# EAGLE schematic Test_Board_RevII (EAGLE 7.1.0)
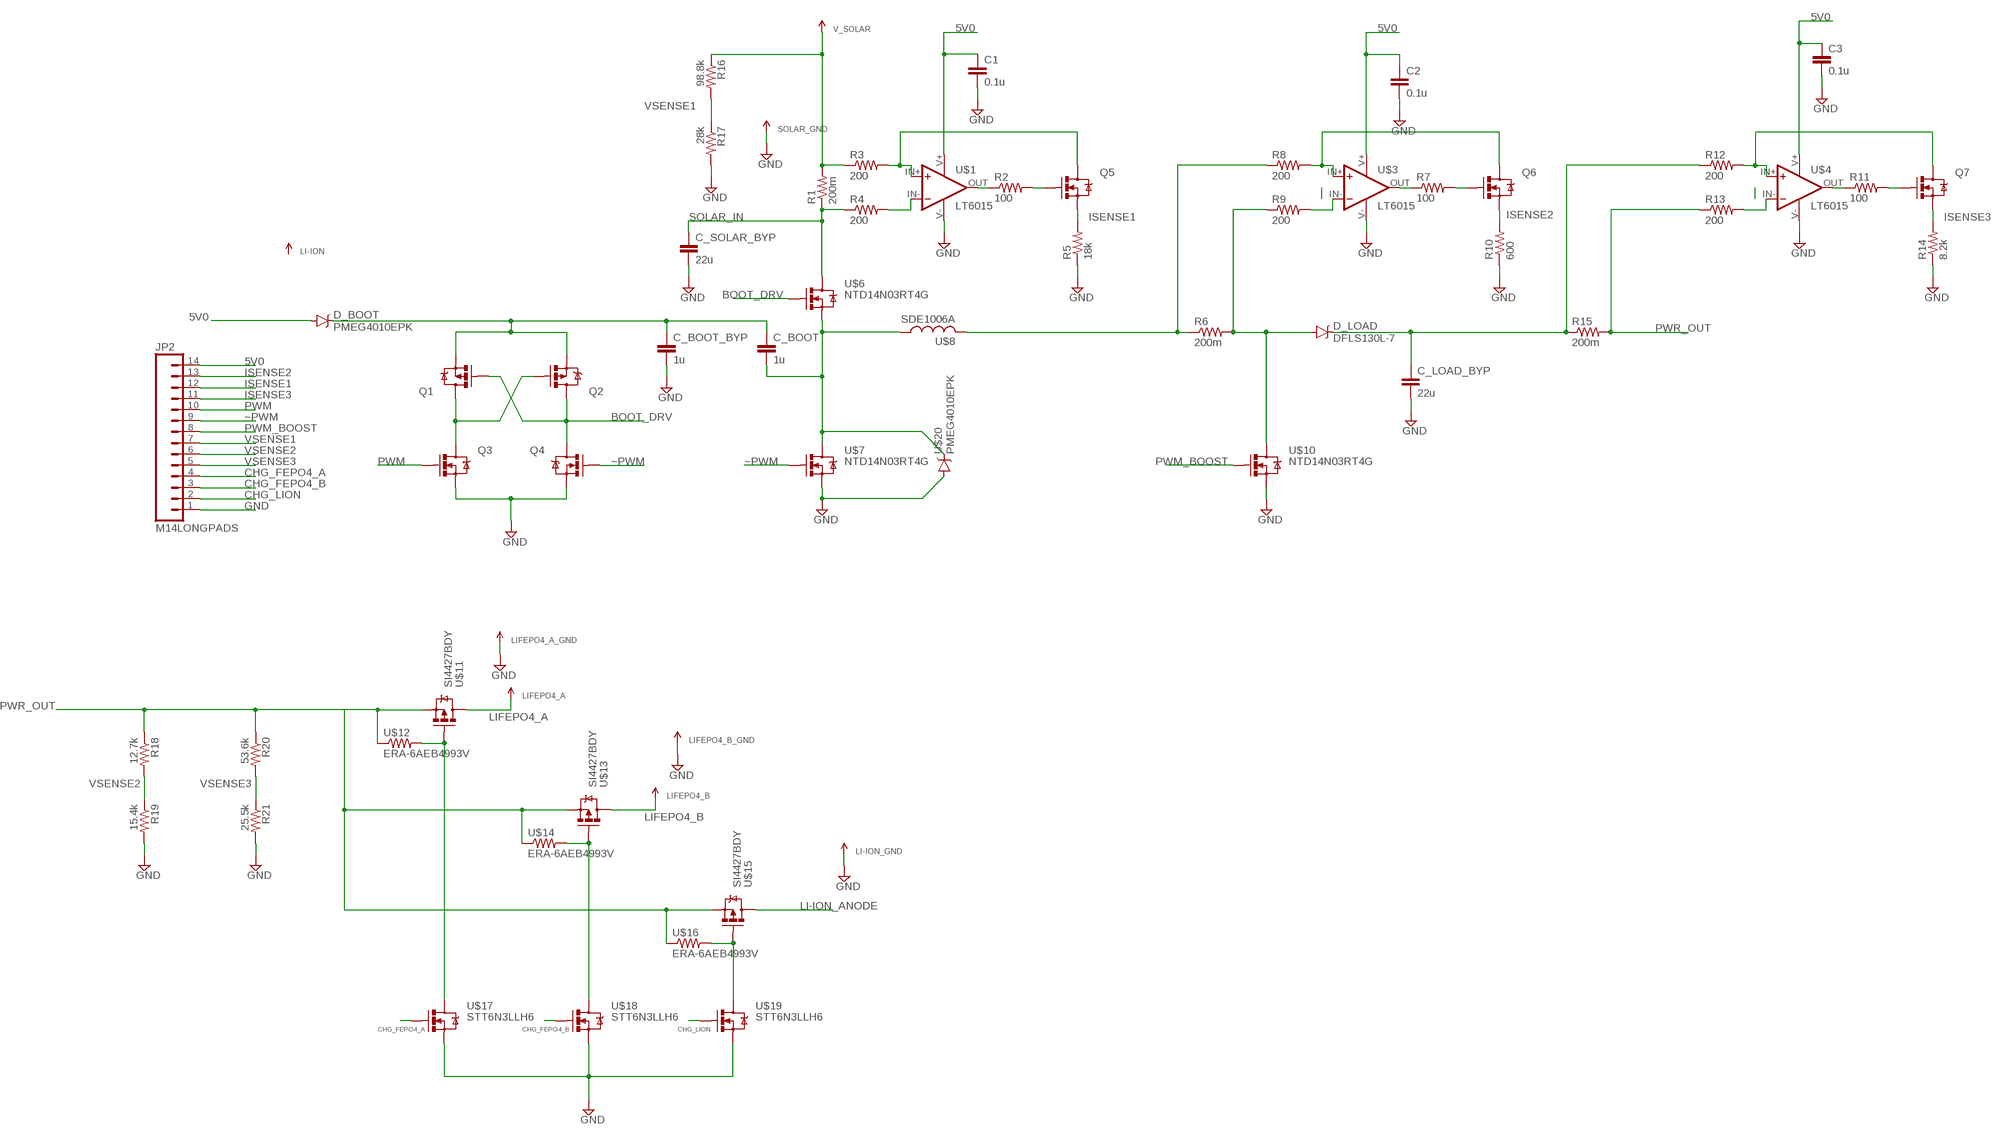
[diagram p0: schematic, sheet 1]

## Parts
C1  0.1u  CAP0805  [0805]
C2  0.1u  CAP0805  [0805]
C3  0.1u  CAP0805  [0805]
C_BOOT  1u  CAP0805  [0805]
C_BOOT_BYP  1u  CAP0805  [0805]
C_LOAD_BYP  22u  CAP1210  [1210]
C_SOLAR_BYP  22u  CAP1210  [1210]
D_BOOT  PMEG4010EPK  [SOD1608]
D_LOAD  DFLS130L-7  [POWER_DI123]
JP2  M14LONGPADS  [1X14-LONGPADS]
LI-ION  VP_VG  [POWER_PAD]
LI-ION_GND  VP_VG  [POWER_PAD]
LIFEPO4_A  VP_VG  [POWER_PAD]
LIFEPO4_A_GND  VP_VG  [POWER_PAD]
LIFEPO4_B  VP_VG  [POWER_PAD]
LIFEPO4_B_GND  VP_VG  [POWER_PAD]
Q1  PMOS  [SC-89]
Q2  PMOS  [SC-89]
Q3  NMOSSOT23-3  [SOT23-3]
Q4  NMOSSOT23-3  [SOT23-3]
Q5  NMOSSOT23-3  [SOT23-3]
Q6  NMOSSOT23-3  [SOT23-3]
Q7  NMOSSOT23-3  [SOT23-3]
R1  200m  RESISTOR  [0805]
R2  100  RESISTOR  [0805]
R3  200  RESISTOR  [0805]
R4  200  RESISTOR  [0805]
R5  18k  RESISTOR  [0805]
R6  200m  RESISTOR  [0805]
R7  100  RESISTOR  [0805]
R8  200  RESISTOR  [0805]
R9  200  RESISTOR  [0805]
R10  600  RESISTOR  [0805]
R11  100  RESISTOR  [0805]
R12  200  RESISTOR  [0805]
R13  200  RESISTOR  [0805]
R14  8.2k  RESISTOR  [0805]
R15  200m  RESISTOR  [0805]
R16  98.8k  RESISTOR  [0805]
R17  28k  RESISTOR  [0805]
R18  12.7k  RESISTOR  [0805]
R19  15.4k  RESISTOR  [0805]
R20  53.6k  RESISTOR  [0805]
R21  25.5k  RESISTOR  [0805]
SOLAR_GND  VP_VG  [POWER_PAD]
U$1  LT6015  [SOT23-5]
U$3  LT6015  [SOT23-5]
U$4  LT6015  [SOT23-5]
U$6  NTD14N03RT4G  [DPAK]
U$7  NTD14N03RT4G  [DPAK]
U$8  SDE1006A  [SDE1006A_PKG]
U$10  NTD14N03RT4G  [DPAK]
U$11  SI4427BDY  [SO-8_POWER]
U$12  ERA-6AEB4993V  [0805]
U$13  SI4427BDY  [SO-8_POWER]
U$14  ERA-6AEB4993V  [0805]
U$15  SI4427BDY  [SO-8_POWER]
U$16  ERA-6AEB4993V  [0805]
U$17  STT6N3LLH6  [SOT23-6]
U$18  STT6N3LLH6  [SOT23-6]
U$19  STT6N3LLH6  [SOT23-6]
U$20  PMEG4010EPK  [SOD1608]
V_SOLAR  VP_VG  [POWER_PAD]

## Nets
5V0: C1.1 C2.1 C3.1 D_BOOT.ANODE(A) JP2.14 U$1.V+ U$3.V+ U$4.V+
BATTERYOUT: D_LOAD.ANODE(A) R6.2 R9.1 U$10.D
BOOT_DRV: Q1.G Q2.D Q4.D U$6.G
CHG_FEPO4_A: JP2.4 U$17.G
CHG_FEPO4_B: JP2.3 U$18.G
CHG_LION: JP2.2 U$19.G
DIODE_OUT: C_LOAD_BYP.1 D_LOAD.CATHODE(C) R12.1 R15.1
GND: C1.2 C2.2 C3.2 C_BOOT_BYP.2 C_LOAD_BYP.2 C_SOLAR_BYP.2 JP2.1 LI-ION_GND.RAIL LIFEPO4_A_GND.RAIL LIFEPO4_B_GND.RAIL Q3.S Q4.S R5.1 R10.1 R14.1 R17.2 R19.2 R21.2 SOLAR_GND.RAIL U$1.V- U$3.V- U$4.V- U$7.S U$10.S U$17.S U$18.S U$19.S U$20.ANODE(A)
INDUCTOR_CATH: R6.1 R8.1 U$8.CATHODE
ISENSE1: JP2.12 Q5.S R5.2
ISENSE2: JP2.13 Q6.S R10.2
ISENSE3: JP2.11 Q7.S R14.2
LI-ION_ANODE: U$15.D
LIFEPO4_A: LIFEPO4_A.RAIL U$11.D
LIFEPO4_B: LIFEPO4_B.RAIL U$13.D
N$1: Q1.D Q2.G Q3.D
N$3: C_BOOT.2 U$6.S U$7.D U$8.ANODE U$20.CATHODE(C)
N$4: U$15.G U$16.2 U$19.D1(D)
N$5: C_BOOT.1 C_BOOT_BYP.1 D_BOOT.CATHODE(C) Q1.S Q2.S
N$6: U$11.G U$12.2 U$17.D1(D)
N$8: U$13.G U$14.2 U$18.D1(D)
N$20: Q5.D R3.2 U$1.IN+
N$21: R4.2 U$1.IN-
N$22: R2.1 U$1.OUT
N$23: Q5.G R2.2
N$25: Q7.D R12.2 U$4.IN+
N$26: Q6.D R8.2 U$3.IN+
N$27: R9.2 U$3.IN-
N$28: R7.1 U$3.OUT
N$29: Q6.G R7.2
N$31: R13.2 U$4.IN-
N$32: R11.1 U$4.OUT
N$33: Q7.G R11.2
PWM: JP2.10 Q3.G
PWM_BOOST: JP2.8 U$10.G
PWR_OUT: R13.1 R15.2 R18.1 R20.1 U$11.S U$12.1 U$13.S U$14.1 U$15.S U$16.1
RAIL: R1.2 R3.1 R16.1 V_SOLAR.RAIL
SOLAR_IN: C_SOLAR_BYP.1 R1.1 R4.1 U$6.D
VSENSE1: JP2.7 R16.2 R17.1
VSENSE2: JP2.6 R18.2 R19.1
VSENSE3: JP2.5 R20.2 R21.1
~PWM: JP2.9 Q4.G U$7.G
Unconnected: LI-ION.RAIL

## Library data of the parts
C1-C3 C_BOOT C_BOOT_BYP C_LOAD_BYP C_SOLAR_BYP = MPPT_Lib:CAP: Capacitor Standard 0603 ceramic capacitor, and 0.1" leaded capacitor.
D_BOOT U$20 = MPPT_Lib:PMEG4010EPK
D_LOAD = MPPT_Lib:DFLS130L-7
JP2 = SparkFun-Connectors:M14: Header 14 Standard 14-pin 0.1" header. Use with straight break away headers (SKU : PRT-00116), right angle break away headers (PRT-00553), swiss pins (PRT-00743), machine pins (PRT-00117), and female headers (PRT-00115).
LI-ION LI-ION_GND LIFEPO4_A LIFEPO4_A_GND LIFEPO4_B LIFEPO4_B_GND SOLAR_GND V_SOLAR = MPPT_Lib:VP_VG
Q1 Q2 = MPPT_Lib:PMOS
Q3-Q7 = MPPT_Lib:NMOS
R1-R21 = MPPT_Lib:RESISTOR
U$1 U$3 U$4 = MPPT_Lib:LT6015
U$6 U$7 U$10 = MPPT_Lib:NTD14N03RT4G
U$8 = MPPT_Lib:SDE1006A
U$11 U$13 U$15 = MPPT_Lib:SI4427BDY
U$12 U$14 U$16 = MPPT_Lib:ERA-6AEB4993V
U$17-U$19 = MPPT_Lib:STT6N3LLH6